# EAGLE design electronics (EAGLE 9.2.0)
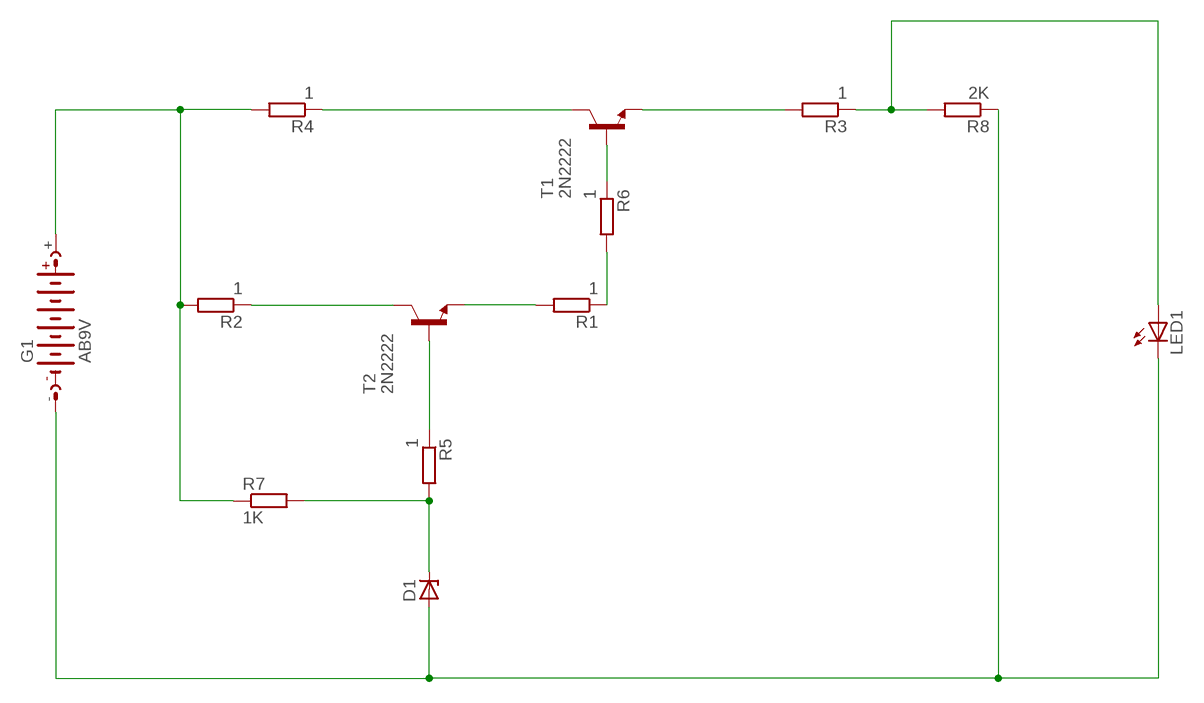
[diagram p0: schematic, sheet 1]

## Parts
D1  ZENER-DIODEF126-12  [F126Z12]
G1  AB9V  [AB9V]
LED1  LED5MM  [LED5MM]
R1  1  R0207/10  [0207/10]
R2  1  R0207/10  [0207/10]
R3  1  R0207/10  [0207/10]
R4  1  R0207/10  [0207/10]
R5  1  R0207/10  [0207/10]
R6  1  R0207/10  [0207/10]
R7  1K  R0207/10  [0207/10]
R8  2K  R0204/7  [0204/7]
T1  2N2222  [TO92-EBC-OVAL]
T2  2N2222  [TO92-EBC-OVAL]

## Nets
N$1: R2.1 T2.C
N$2: R4.1 T1.C
N$3: R6.1 T1.B
N$4: R1.1 R6.2
N$5: R1.2 T2.E
N$6: R5.1 T2.B
N$7: D1.C R5.2 R7.2
N$8: G1.+ R2.2 R4.2 R7.1
N$9: R3.2 T1.E
N$10: LED1.A R3.1 R8.2
N$11: D1.A G1.- LED1.K(C) R8.1

## Library data of the parts
D1 = diode:ZENER-DIODE: Z-Diode
G1 = battery:AB9V: 9-V BATTERY CLIP
LED1 = adafruit:LED: LED OSRAM: - CHIPLED LG R971, LG N971, LY N971, LG Q971, LY Q971, LO R971, LY R971 LH N974, LH R974 LS Q976, LO Q976, LY Q976 LO Q996 - Hyper CHIPLED LW Q18S LB Q993, LB Q99A, LB R99A - SideLED LS A670, LO A670, LY A670, LG A670, LP A670 LB A673, LV A673, LT A673, LW A673 LH A674 LY A675 LS A676, LA A676, LO A676, LY A676, LW A676 LS A679, LY A679, LG A679 - Hyper Micro SIDELED® LS Y876, LA Y876, LO Y876, LY Y876 LT Y87S - SmartLED LW L88C, LW L88S LB L89C, LB L89S, LG L890 LS L89K, LO L89K, LY L89K LS L896, LA L896, LO L896, LY L896 - TOPLED LS T670, LO T670, LY T670, LG T670, LP T670 LSG T670, LSP T670, LSY T670, LOP T670, LYG T670 LG T671, LOG T671, LSG T671 LB T673, LV T673, LT T673, LW T673 LH T674 LS T676, LA T676, LO T676, LY T676, LB T676, LH T676, LSB T676, LW T676 LB T67C, LV T67C, LT T67C, LS T67K, LO T67K, LY T67K, LW E67C LS E67B, LA E67B, LO E67B, LY E67B, LB E67C, LV E67C, LT E67C LW T67C LS T679, LY T679, LG T679 LS T770, LO T770, LY T770, LG T770, LP T770 LB T773, LV T773, LT T773, LW T773 LH T774 LS E675, LA E675, LY E675, LS T675 LS T776, LA T776, LO T776, LY T776, LB T776 LHGB T686 LT T68C, LB T68C - Hyper Mini TOPLED® LB M676 - Mini TOPLED Santana® LG M470 LS M47K, LO M47K, LY M47K Source: http://www.osram.convergy.de/
R1-R8 = eagle-ltspice:R: RESISTOR, European symbol; SPICEMODEL: NONE; SPICEPREFIX: R
T1 T2 = adafruit:2N2222: NPN TRANSISTOR Big oval pads

## Board
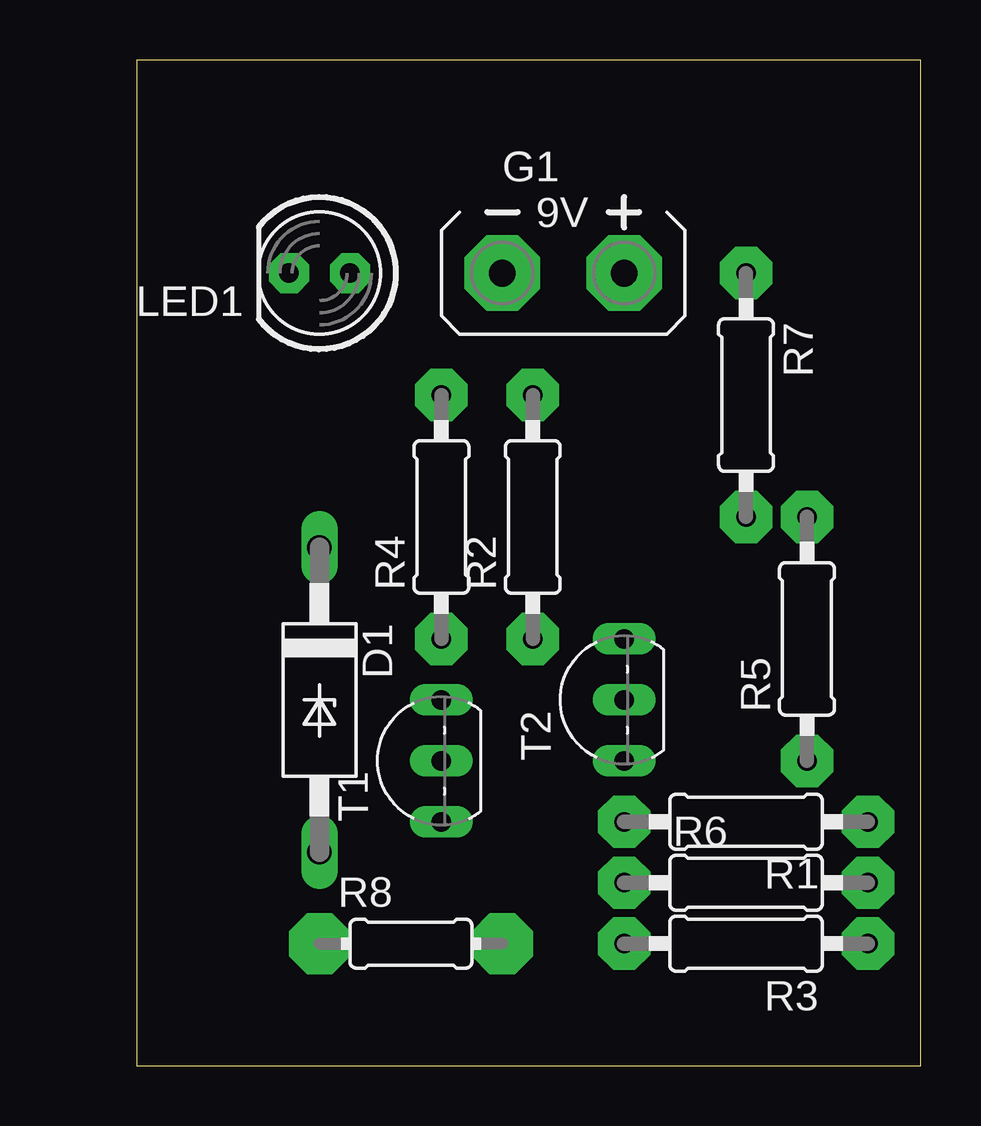
[diagram p1: board, top side]
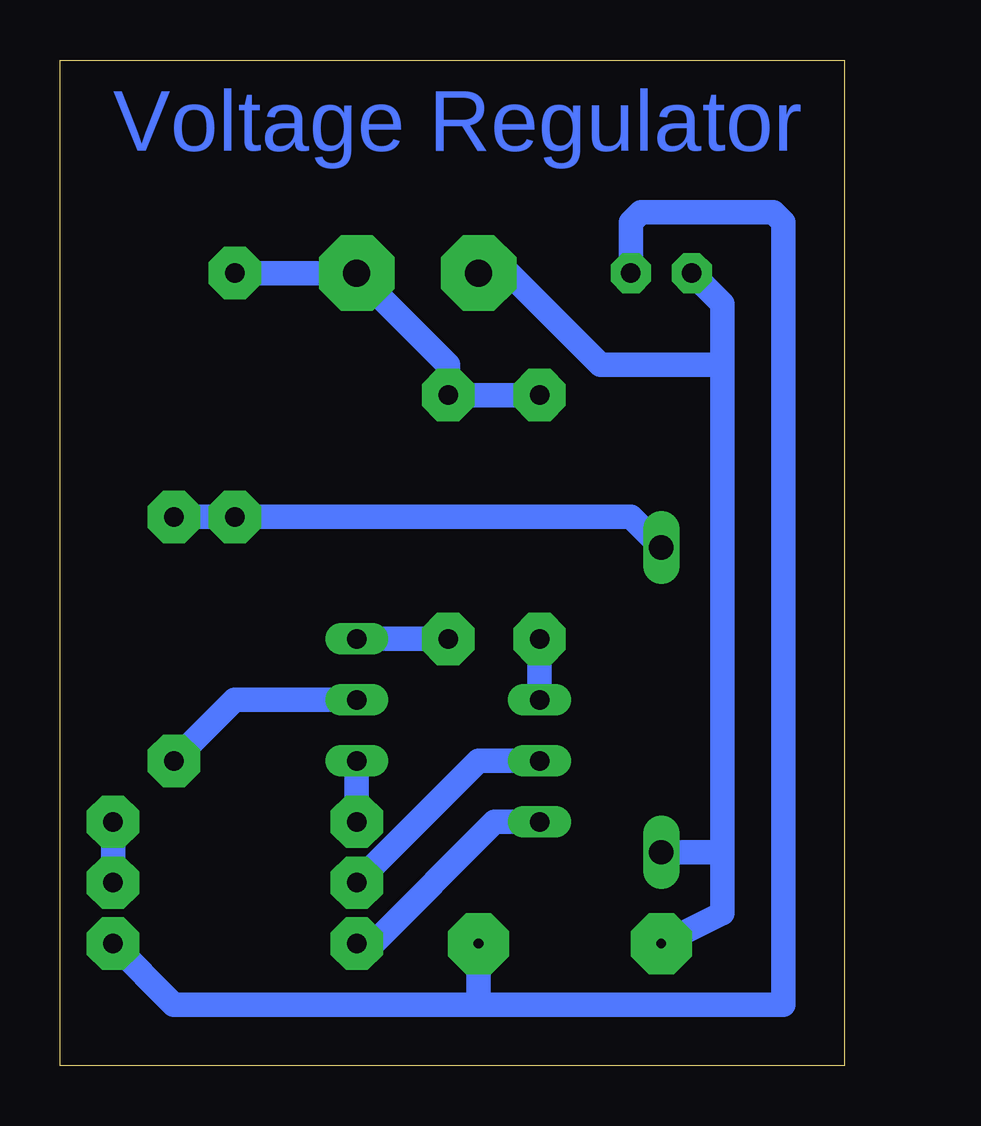
[diagram p2: board, bottom side, seen from below]

Size 32.69 x 41.9 mm. Coordinates in mm from the lower left corner, seen from the top.
Outline: 0,0 32.69,0 32.69,41.9 0,41.9 0,0
Copper layers (1*16): Top 0.035mm / dielectric 1.5mm / Bottom 0.035mm
Design rules "default": minimum track width 6mil, minimum drill 0.35mm, track to track 6mil, track to pad 6mil, pad to pad 6mil, via to via 6mil, smd to smd 6mil, copper to edge 40mil, drill to drill 6mil, minimum pad ring 10mil, minimum via ring 8mil, stop-mask expansion 4mil, vias tented up to drill 0mil, thermal gap 10mil

### Footprints (pad centres in the part's own frame; a part is rotated, then mirrored left to right if it is on the bottom)
F126Z12 = drill 1.016 long: A 6.35,0; C -6.35,0
AB9V = drill 1.118 pad 3.15 octagon: + 0,2.54; - 0,-2.54
LED5MM = drill 0.813 pad 1.676 octagon: A -1.27,0; K 1.27,0
0207/10 = drill 0.813 pad 2.184 octagon: 1 -5.08,0; 2 5.08,0
0204/7 = drill 0.4 pad 2.54 octagon: 1 -3.81,0; 2 3.81,0
TO92-EBC-OVAL = drill 0.813 long: B 0,-1.27; C 2.54,-1.27; E -2.54,-1.27

### Placement (x,y rotation side)
D1  7.62,15.24 270 top
G1  17.78,33.02 270 top
LED1  7.62,33.02 180 top
R1  25.4,10.16 180 top
R2  16.51,22.86 90 top
R3  25.4,5.08 180 top
R4  12.7,22.86 90 top
R5  27.94,17.78 90 top
R6  25.4,7.62 0 top
R7  25.4,27.94 270 top
R8  11.43,5.08 0 top
T1  11.43,12.7 90 top
T2  19.05,15.24 90 top

### Tracks (layer width: path | path; a pad name or v marks a point on that pad's centre or on a via)
N$1
  Bottom 1.016: T2.C R2.1
N$2
  Bottom 1.016: R4.1 T1.C
N$3
  Bottom 1.016: T1.B 15.24,12.7 R6.1
N$4
  Bottom 1.016: R1.1 R6.2
N$5
  Bottom 1.016: T2.E R1.2
N$6
  Bottom 1.016: R5.1 25.4,15.24 T2.B
N$7
  Bottom 1.016: D1.C 8.89,22.86 R7.2 R5.2
N$8
  Bottom 1.016: R4.2 R2.2 16.51,29.21 G1.+ R7.1
N$9
  Bottom 1.016: T1.E 14.57,10.16 19.65,5.08 R3.2
N$10
  Bottom 1.016: LED1.A 8.89,35.14 8.47,35.56 2.96,35.56 2.54,35.14 2.54,2.54 15.24,2.54 | R3.1 27.94,2.54 15.24,2.54 | R8.2 15.24,2.54
N$11
  Bottom 1.016: LED1.K 5.08,31.75 5.08,29.21 | R8.1 5.08,6.35 5.08,8.89 | 5.08,29.21 5.08,8.89 | 5.08,29.21 10.16,29.21 13.97,33.02 G1.- | D1.A 5.08,8.89

### Text on the board
Bottom: Voltage Regulator